# Altium schematic sheet Connectors.SchDoc
size A; SheetNumber: 1; SheetTotal: 5
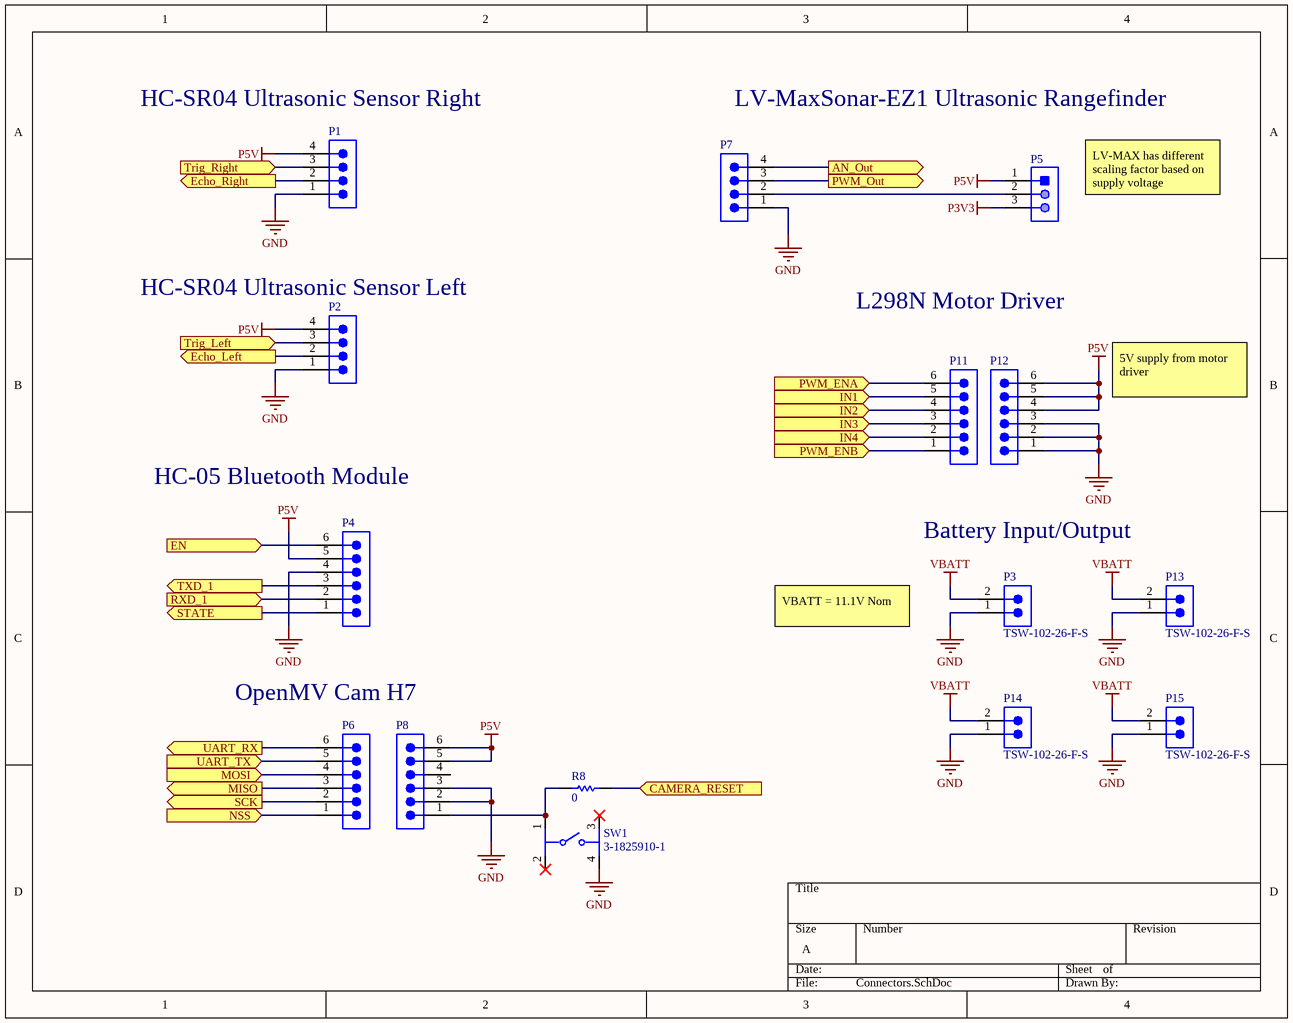
[diagram p0: Connectors.SchDoc]

## Parts
P1  TSW-104-08-T-S  [SMTC-TSW-104-08-X-S]  (value not drawn)
P2  TSW-104-08-T-S  [SMTC-TSW-104-08-X-S]  (value not drawn)
P3  TSW-102-26-F-S  [SMTC-TSW-102-26-XX-S]
P4  TSW-106-23-G-S  [SMTC-TSW-106-23-X-S]  (value not drawn)
P5  87224-3  [TECO-87224-3_V]  (value not drawn)
P6  TSW-106-23-G-S  [SMTC-TSW-106-23-X-S]  (value not drawn)
P7  TSW-104-08-T-S  [SMTC-TSW-104-08-X-S]  (value not drawn)
P8  TSW-106-23-G-S  [SMTC-TSW-106-23-X-S]  (value not drawn)
P11  TSW-106-23-G-S  [SMTC-TSW-106-23-X-S]  (value not drawn)
P12  TSW-106-23-G-S  [SMTC-TSW-106-23-X-S]  (value not drawn)
P13  TSW-102-26-F-S  [SMTC-TSW-102-26-XX-S]
P14  TSW-102-26-F-S  [SMTC-TSW-102-26-XX-S]
P15  TSW-102-26-F-S  [SMTC-TSW-102-26-XX-S]
R8  value 0  [RESC3216X60X45ML15T20]  (hidden comment: Resistor 0R +/- 5% 1206 250 mW)
SW1  3-1825910-1  [FP-3-1825910-1-MFG]

## Ports
AN_Out (out), CAMERA_RESET (in), Echo_Left (out), Echo_Right (out), EN (in), IN1 (in), IN2 (in), IN3 (in), IN4 (in), MISO (out), MOSI (in), NSS (in), PWM_ENA (in), PWM_ENB (in), PWM_Out (out), RXD_1 (in), SCK (out), STATE (out), Trig_Left (in), Trig_Right (in), TXD_1 (out), UART_RX (out), UART_TX (in)

## Nets
GND: P1.1 P2.1 P3.1 P4.4 P7.1 P8.2 P8.3 P12.1 P12.2 P12.3 P13.1 P14.1 P15.1 SW1.4
P3V3: P5.3
P5V: P1.4 P2.4 P4.5 P5.1 P8.5 P8.6 P12.4 P12.5 P12.6
VBATT: P3.2 P13.2 P14.2 P15.2
AN_Out: P7.4 ; port AN_Out
CAMERA_RESET: R8.2 ; port CAMERA_RESET
Echo_Left: P2.2 ; port Echo_Left
Echo_Right: P1.2 ; port Echo_Right
EN: P4.6 ; port EN
IN1: P11.5 ; port IN1
IN2: P11.4 ; port IN2
IN3: P11.3 ; port IN3
IN4: P11.2 ; port IN4
MISO: P6.3 ; port MISO
MOSI: P6.4 ; port MOSI
NSS: P6.1 ; port NSS
PWM_ENA: P11.6 ; port PWM_ENA
PWM_ENB: P11.1 ; port PWM_ENB
PWM_Out: P7.3 ; port PWM_Out
RXD_1: P4.2 ; port RXD_1
SCK: P6.2 ; port SCK
STATE: P4.1 ; port STATE
Trig_Left: P2.3 ; port Trig_Left
Trig_Right: P1.3 ; port Trig_Right
TXD_1: P4.3 ; port TXD_1
UART_RX: P6.6 ; port UART_RX
UART_TX: P6.5 ; port UART_TX
NetP5_2: P5.2 P7.2
NetP8_1: P8.1 R8.1 SW1.1

Not connected (* = marked no-connect by the designer): P8 4; SW1 2* 3*

## Notes on the sheet
- (near P1) HC-SR04 Ultrasonic Sensor Right
- LV-MaxSonar-EZ1 Ultrasonic Rangefinder
- LV-MAX has different scaling factor based on supply voltage
- (near P2) HC-SR04 Ultrasonic Sensor Left
- L298N Motor Driver
- 5V supply from motor driver
- HC-05 Bluetooth Module
- Battery Input/Output
- VBATT = 11.1V Nom
- OpenMV Cam H7

## Library data of the parts
P1 P2 P7 = CMP-1024-00356-1: 0.025" SQ Post Header, Through-hole, Vertical, -55 to 105 degC, 2.54 mm Pitch, 4-Pin, Male, RoHS; Manufacturer: Samtec; Pitch: 2.54 mm; PackageDescription: .025[0.64] SQ. Post Terminal Strip Assembly; ComponentLink2URL: http://www.samtec.com/documents/webfiles/pdf/TSW_TH.PDF; ComponentLink3URL: http://www.samtec.com/documents/webfiles/cpdf/TSW-XXX-XX-XXX-X-XX-XXX-MKT.pdf; PackageVersion: DM, 8/1988; ComponentLink3Description: Package Specification; DatasheetVersion: F-214; Orientation: Vertical; RoHS: True; Mounting Technology: Through-hole; ComponentLink1URL: http://www.samtec.com; PartNumber: TSW-104-08-T-S; ComponentLink1Description: Manufacturer URL; Temperature Range: -55 to 105 degC; ComponentLink2Description: Datasheet; PackageReference: TSW-104-08-X-S
P3 P13-P15 = CMP-002-00072-1: Headers & Wire Housings Classic PCB Header Strips, 0.100 pitch; Number of Positions: 2; Max Voltage Rating (AC): 550V; Gender: Male; Pitch: 2.54mm; Contact Post Length: 3.2mm; Voltage Rating: 500V; Max Current Rating: 7.6A; Contact Material: Bronze; Contact Gender: Male; Contact Type: -; REACH SVHC: No SVHC; Min Operating Temperature: -55°C; Housing Material: Polyester; Packaging: Bulk; Termination: Through Hole; Max Operating Temperature: 125°C; Orientation: Vertical; Flammability Rating: UL94 V-0; Package Quantity: 1; Depth: 2.54mm; Contact Plating: Gold; Number of Rows: 1; Radiation Hardening: No; Number of Contacts: 2; Length: 5.08mm; RoHS Compliant: Yes; Housing Color: Black; Weight: 0.001257oz; Contact Mating Length: 5.84mm; Series: TSW
P4 P6 P8 P11 P12 = CMP-1024-00396-1: 0.025" SQ Post Header, Through-hole, Vertical, -55 to 125 degC, 2.54 mm Pitch, 6-Pin, Male, RoHS; Manufacturer: Samtec; Pitch: 2.54 mm; Orientation: Vertical; Mounting Technology: Through-hole; RoHS: True; PackageVersion: DM, 8/1988; ComponentLink3Description: Package Specification; PackageDescription: .025[0.64] SQ. Post Terminal Strip Assembly; ComponentLink2URL: http://www.samtec.com/documents/webfiles/pdf/TSW_TH.PDF; PartNumber: TSW-106-23-G-S; Temperature Range: -55 to 125 degC; PackageReference: TSW-106-23-X-S; ComponentLink1Description: Manufacturer URL; ComponentLink2Description: Datasheet; ComponentLink3URL: http://www.samtec.com/documents/webfiles/cpdf/TSW-XXX-XX-XXX-X-XX-XXX-MKT.pdf; DatasheetVersion: F-214; ComponentLink1URL: http://www.samtec.com
P5 = CMP-2000-05697-1: Male Header, Pitch 2.54 mm, 1 x 3 Position, Height 10.744 mm, Tail Length 3.175 mm, -65 to 105 degC, RoHS, Bulk; Manufacturer: TE Connectivity; Catalog Drawings: SingleSquareStraightPost / SingleSquareStraightPostSide; Connector Type: Header,Unshrouded; Pitch: 0.100"(2.54mm); Mating Products: 147738-2-ND / -CONNRCPT3POSVERTSMDGOLD / 147723-2-ND / -CONNRCPT3POSVERT.100GOLD / 146763-5-ND / -CONNRCPT3POSSGLVERT.100T/H / A32904-ND / -CONNRECEPT3POS.100VERTGOLD / A26922-ND / -CONNHOUSING3POS.100LOCKING / A26415-ND / -CONNRECEPT3POS.100VERTAU / A26964-ND / -CONNHOUSING3POS.100SINGLE / A3012-ND / -CONNHOUSING3POS.100SINGLE; Number of Positions Loaded: All; Featured Product: AMPMODUConnectors; Dynamic Catalog: AMPMODUModIISeries; 3D Model: 87224-3.pdf; Other Names: 87224-3-ND / A26545; Number of Positions: 3; RoHS Information: 87224-3StatementofCompliance; Termination: Solder; Datasheet URL: http://www.te.com/commerce/DocumentDelivery/DDEController?Action=showdoc&DocId=Customer+Drawing%7F87224%7FL3%7Fpdf%7FEnglish%7FENG_CD_87224_L3.pdf%7F87224-3; Category: Connectors,Interconnects; Contact Mating Length: 0.318"(8.08mm); Standard Package: 520; Mounting Type: ThroughHole; Family: RectangularConnectors-Headers,MalePins; Number of Rows: 1; Series: AMPMODUModII; Contact Finish Thickness: 15µin(0.38µm); Datasheet Version: Rev. L3, 08/2015; Package Reference: 87224-3; Mounting Technology: ThroughHole; Manufacturer URL: http://www.te.com/; Contact Type: MalePin; Packaging: Bulk; Color: Black; Package Description: Male Header, Pitch 2.54 mm, 1 x 3 Position, Height 10.744 mm, Tail Length 3.175 mm; Contact Finish: Gold
R8 = CMP-009-00002-4: Chip Resistor, 0 Ohm, +/- 5%, 0.25 W, -55 to 155 degC, 1206 (3216 Metric); Voltage Rating: 200V; Power: 250mW; Case/Package: 1206; Mounting Technology: SM; RoHS Compliant: True; Min Operating Temperature: -55°C; Max Operating Temperature: 155°C; Tolerance: 5%; Pins: 2
SW1 = CMP-03407-000001-1: SWITCH TACTILE SPST-NO 0.05A 24V; Manufacturer: TE Connectivity; Operating Force: 160gf; Contact Current Rating: 50mA; Description: Switch Tactile OFF (ON) SPST Round Button PC Pins 0.05A 24VDC 100000Cycles 1.57N Thru-Hole; Contact Resistance: 100mΩ; Electromechanical Life: 100000Cycles; Device Class L1: Electromechanical; ComponentLink2URL: https://www.te.com/commerce/DocumentDelivery/DDEController?Action=srchrtrv&DocNm=1825910&DocType=Customer+Drawing&DocLang=English; Category: Switch; Device Class L2: Switches; Temperature: -35°C to +85°C; RoHS: TRUE; Mount: Through Hole; Manufacturer Part Number: 3-1825910-1; Automotive: No; Lead Free: Yes; Device Class L3: Tactile Switches; ComponentLink2Description: Datasheet; Temperature Range High: +85°C; Height: 17.3mm; Package: 0; Temperature Range Low: -35°C; Throw Configuration: SPST-NO; Digikey Description: SWITCH TACTILE SPST-NO 0.05A 24V; Octopart: https://octopart.com/3-1825910-1-te+connectivity-46506874